# Altium schematic sheet Quad_SPI_Memory.SchDoc: Quad SPI Memory
size A; Revision: 1
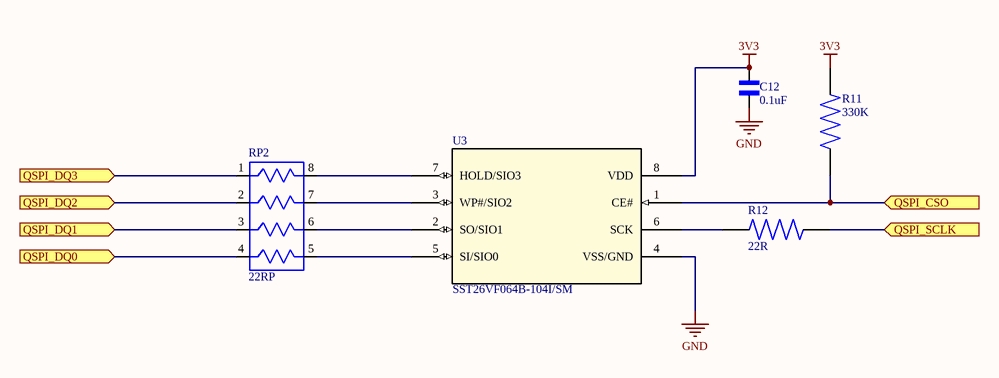
[diagram p0: Quad_SPI_Memory.SchDoc]

## Parts
C12  0.1uF  [C0402]
R11  330K  [R0603 Vishay]
R12  22R  [R0402 Vishay]
RP2  22RP  [RESCAXS50P200X100X55-8N]
U3  SST26VF064B-104I/SM  [SST26VF064B-104V/SM]

## Ports
QSPI_CSO (in), QSPI_DQ0 (in), QSPI_DQ1 (in), QSPI_DQ2 (in), QSPI_DQ3 (in), QSPI_SCLK (in)

## Nets
3V3: C12.2 R11.2 U3.8(VDD)
GND: C12.1 U3.4(VSS/GND)
QSPI_CSO: R11.1 U3.1(CE#) ; port QSPI_CSO
QSPI_DQ0: RP2.4 ; port QSPI_DQ0
QSPI_DQ1: RP2.3 ; port QSPI_DQ1
QSPI_DQ2: RP2.2 ; port QSPI_DQ2
QSPI_DQ3: RP2.1 ; port QSPI_DQ3
QSPI_SCLK: R12.2 ; port QSPI_SCLK
NetR12_1: R12.1 U3.6(SCK)
NetRP2_5: RP2.5 U3.5(SI/SIO0)
NetRP2_6: RP2.6 U3.2(SO/SIO1)
NetRP2_7: RP2.7 U3.3(WP#/SIO2)
NetRP2_8: RP2.8 U3.7(HOLD/SIO3)

## Library data of the parts
C12 = GRM022R60J104KE15L: CAP CER 0.1UF 6.3V X5R 01005; Manufacturer: Murata; Capacitance: 100nF; Tolerance: 10%; Supplier 1: Digi-Key; Manufacturer Part Number: GRM022R60J104KE15L; RoHS: No; Category: Ceramic Capacitors; Stock 1: 633064; Pricing 1: 1=0.13000, 10=0.09000, 50=0.05080, 100=0.04210, 500=0.02952, 1000=0.02444, 2500=0.02275, 5000=0.02081 (USD); Mount: Surface Mount; Case Code (Imperial): 1005; Case Code (Metric): 0402; Min Operating Temperature: -55°C; Max Operating Temperature: 85°C; Packaging: Cut Tape; Voltage Rating: 6.3V; ComponentLink1URL: http://search.murata.co.jp/Ceramy/image/img/A01X/G101/ENG/GRM022R60J104KE15-01.pdf?src-supplier=Digi-Key; ComponentLink1Description: http://search.murata.co.jp/Ceramy/image/img/A01X/G101/ENG/GRM022R60J104KE15-01.pdf?src-supplier=Digi-Key; Supplier Part Number 1: 490-16598-1-ND
R11 = CRCW0201330KFNED: VISHAY   CRCW0201330KFNED   Surface Mount Chip Resistor, Thick Film, AEC-Q200 CRCW Series, 330 kohm, 50 mW,  1%, 30 V; Resistance: 330kR; Power Rating: 50mW; Voltage Rating: 30V; Temperature Coefficient: 200ppm/°C; Supplier 1: Digi-Key; Manufacturer: Vishay; Manufacturer Part Number: CRCW0201330KFNED; RoHS: Yes; Category: Chip SMD Resistors; Stock 1: 7255; Pricing 1: 1=0.10000, 10=0.05700, 100=0.02300, 1000=0.01034, 2500=0.00897, 5000=0.00741 (USD); Case/Package: 0201; Case Code (Metric): 0603; Case Code (Imperial): 0201; Contact Plating: Tin; Min Operating Temperature: -55°C; Max Operating Temperature: 155°C; Packaging: Tape and Reel; Tolerance: 1%; Package Quantity: 10000; Resistor Type: Thick Film; Number of Terminations: 2; Max Power Dissipation: 50mW; Voltage Rating (DC): 30V; Length: 0.024inch; Width: 0.012inch; Height: 0.011inch; Radiation Hardening: No; REACH SVHC: Unknown; Lead Free: Lead Free; ComponentLink1URL: https://datasheet.ciiva.com/22708/1719906-22708398.pdf?src-supplier=Element14; ComponentLink1Description: https://datasheet.ciiva.com/22708/1719906-22708398.pdf?src-supplier=Element14; Supplier Part Number 1: 541-CRCW0201330KFNEDCT-ND
R12 = CRCW040222R0FKED: VISHAY - CRCW040222R0FKED. - Resistor Case Style:0402 [1005 Metric], 22ohm; Power Rating: 63mW; Tolerance: 1%; Voltage Rating: 50V; Temperature Coefficient: 100ppm/°C; Supplier 1: Digi-Key; Manufacturer: Vishay; Manufacturer Part Number: CRCW040222R0FKED; RoHS: Yes; Category: Chip SMD Resistors; Stock 1: 167744; Pricing 1: 1=0.10000, 10=0.03300, 100=0.01330, 1000=0.00596, 2500=0.00518, 5000=0.00428 (USD); Mount: Surface Mount; Case/Package: 0402; Weight: 2.3E-05oz; Case Code (Metric): 1005; Case Code (Imperial): 0402; Contact Plating: Tin; Min Operating Temperature: -55°C; Max Operating Temperature: 155°C; Resistance: 22R; Packaging: Tape and Reel; Package Quantity: 10; Resistor Type: Thick Film; Number of Terminations: 2; Termination: SMD/SMT; Max Power Dissipation: 63mW; Voltage Rating (DC): 50V; Features: Automotive AEC-Q200; Length: 1mm; Width: 0.02inch; Height: 0.35mm; Depth: 0.5mm; Radiation Hardening: No; Lead Free: Lead Free; REACH SVHC: Unknown; Military Standard: Not; ComponentLink1URL: https://datasheet.ciiva.com/11809/0900766b80d98824-11809869.pdf?src-supplier=RSComponents; ComponentLink1Description: https://datasheet.ciiva.com/11809/0900766b80d98824-11809869.pdf?src-supplier=RSComponents; ComponentLink2URL: https://datasheet.ciiva.com/3256/dcrcwe3-3256250.pdf?src-supplier=Avnet; ComponentLink2Description: https://datasheet.ciiva.com/3256/dcrcwe3-3256250.pdf?src-supplier=Avnet; ComponentLink3URL: https://datasheet.ciiva.com/16776/70201119-16776426.pdf?src-supplier=Allied+Electronics; ComponentLink3Description: https://datasheet.ciiva.com/16776/70201119-16776426.pdf?src-supplier=Allied+Electronics; ComponentLink4URL: https://datasheet.ciiva.com/26316/fld-crcw-e3-data-en-26316666.pdf?src-supplier=Distrelec; ComponentLink4Description: https://datasheet.ciiva.com/26316/fld-crcw-e3-data-en-26316666.pdf?src-supplier=Distrelec; ComponentLink5URL: https://datasheet.ciiva.com/16886/dcrcwe3-16886668.pdf?src-supplier=Avnet+Europe; ComponentLink5Description: https://datasheet.ciiva.com/16886/dcrcwe3-16886668.pdf?src-supplier=Avnet+Europe; ComponentLink6URL: https://datasheet.ciiva.com/7672/1697337-7672781.pdf?src-supplier=Element14; ComponentLink6Description: https://datasheet.ciiva.com/7672/1697337-7672781.pdf?src-supplier=Element14; ComponentLink7URL: https://datasheet.ciiva.com/7672/1697337-7672782.pdf?src-supplier=Element14; ComponentLink7Description: https://datasheet.ciiva.com/7672/1697337-7672782.pdf?src-supplier=Element14; ComponentLink8URL: https://datasheet.ciiva.com/2463/dcrcwe3-2463093.pdf?src-supplier=Digi-Key; ComponentLink8Description: https://datasheet.ciiva.com/2463/dcrcwe3-2463093.pdf?src-supplier=Digi-Key; ComponentLink9URL: https://datasheet.ciiva.com/16396/dcrcwe3-16396918.pdf?src-supplier=Future+Electronics; ComponentLink9Description: https://datasheet.ciiva.com/16396/dcrcwe3-16396918.pdf?src-supplier=Future+Electronics; ComponentLink10URL: https://datasheet.ciiva.com/3256/dcrcwe3-3256249.pdf?src-supplier=Avnet; ComponentLink10Description: https://datasheet.ciiva.com/3256/dcrcwe3-3256249.pdf?src-supplier=Avnet; ComponentLink11URL: https://datasheet.ciiva.com/5552/dcrcwe3-109170-5552201.pdf?src-supplier=Mouser; ComponentLink11Description: https://datasheet.ciiva.com/5552/dcrcwe3-109170-5552201.pdf?src-supplier=Mouser; ComponentLink12URL: https://datasheet.ciiva.com/2463/dcrcwe3-2463091.pdf?src-supplier=Digi-Key; ComponentLink12Description: https://datasheet.ciiva.com/2463/dcrcwe3-2463091.pdf?src-supplier=Digi-Key; ComponentLink13URL: https://datasheet.ciiva.com/2463/dcrcwe3-2463092.pdf?src-supplier=Digi-Key; ComponentLink13Description: https://datasheet.ciiva.com/2463/dcrcwe3-2463092.pdf?src-supplier=Digi-Key; Supplier Part Number 1: 541-22.0LCT-ND
RP2 = YC124-JR-0722RL: RES ARRAY 4 RES 22 OHM 0804; Manufacturer: Yageo; Number of Terminals/Pins: 8; Number of Circuits: 4; Resistance: 22R; Tolerance: 5%; Power Rating: 62.5mW; Voltage Rating: 50V; Circuit Type: Isolated; Temperature Coefficient: 200ppm/°C; Supplier 1: Digi-Key; Manufacturer Part Number: YC124-JR-0722RL; RoHS: Yes; Category: Resistor Arrays; Stock 1: 239833; Pricing 1: 1=0.10000, 10=0.07100, 25=0.05120, 50=0.03900, 100=0.02880, 250=0.02196, 500=0.01756, 1000=0.01293, 5000=0.00927 (USD); Mount: Surface Mount; Case/Package: 0402; Number of Pins: 8; Case Code (Metric): 1005; Case Code (Imperial): 0402; Min Operating Temperature: -55°C; Max Operating Temperature: 155°C; Number of Contacts: 8; Package Quantity: 1; Packaging: Tape and Reel; Number of Elements: 4; Number of Resistors: 4; Power Per Element: 62.5mW; Termination: Convex; Power Dissipation: 62.5mW; Working Voltage: 50V; Length: 0.079inch; Width: 0.039inch; Height: 0.022inch; Terminal Pitch: 0.5mm; Depth: 1mm; Lead Free: Lead Free; REACH SVHC: Unknown; Military Standard: Not; ComponentLink1URL: https://datasheet.ciiva.com/2688/pyu-yc-tc124-51-rohs-l-3-2688672.pdf?src-supplier=Digi-Key; ComponentLink1Description: https://datasheet.ciiva.com/2688/pyu-yc-tc124-51-rohs-l-3-2688672.pdf?src-supplier=Digi-Key; ComponentLink2URL: https://datasheet.ciiva.com/2688/pyu-yc-tc124-51-rohs-l-3-2688673.pdf?src-supplier=Digi-Key; ComponentLink2Description: https://datasheet.ciiva.com/2688/pyu-yc-tc124-51-rohs-l-3-2688673.pdf?src-supplier=Digi-Key; ComponentLink3URL: https://datasheet.ciiva.com/8017/1508227-8017861.pdf?src-supplier=Element14; ComponentLink3Description: https://datasheet.ciiva.com/8017/1508227-8017861.pdf?src-supplier=Element14; ComponentLink4URL: https://datasheet.ciiva.com/7620/442851-7620729.pdf?src-supplier=Element14; ComponentLink4Description: https://datasheet.ciiva.com/7620/442851-7620729.pdf?src-supplier=Element14; ComponentLink5URL: https://datasheet.ciiva.com/8017/1508227-8017862.pdf?src-supplier=Element14; ComponentLink5Description: https://datasheet.ciiva.com/8017/1508227-8017862.pdf?src-supplier=Element14; ComponentLink6URL: https://datasheet.ciiva.com/17067/pyu-yc-tc124-51-rohs-l-3-17067068.pdf?src-supplier=Future+Electronics; ComponentLink6Description: https://datasheet.ciiva.com/17067/pyu-yc-tc124-51-rohs-l-3-17067068.pdf?src-supplier=Future+Electronics; ComponentLink7URL: https://datasheet.ciiva.com/2688/pyu-yc-tc124-51-rohs-l-3-2688671.pdf?src-supplier=Digi-Key; ComponentLink7Description: https://datasheet.ciiva.com/2688/pyu-yc-tc124-51-rohs-l-3-2688671.pdf?src-supplier=Digi-Key; Supplier Part Number 1: YC124J-22CT-ND
U3 = SST26VF064B-104I/SM: Quad SPI Memory; Flash Serial 3V 64Mbit 64M x 1Bit 8-Pin SOIJ; Vendor: Microchip; Built_By: EMA_Cory; SourceLibrary: Microchip_2020-09-08; Datasheet: https://ww1.microchip.com/downloads/en/DeviceDoc/SST26VF064B-SST26VF064BA-2.5V-3.0V-64-Mbit-Serial-Quad-IO-Flash-Memory-Data-Sheet-DS20005119J.pdf; Manufacturer_Part_Number: SST26VF064B-104I/SM; Copyright: Copyright (C) 2018 Accelerated Designs. All rights reserved; RefDes: RefDes; Type: DEV